# EAGLE design Quad-Thermocouple-Interface (EAGLE 6.1)
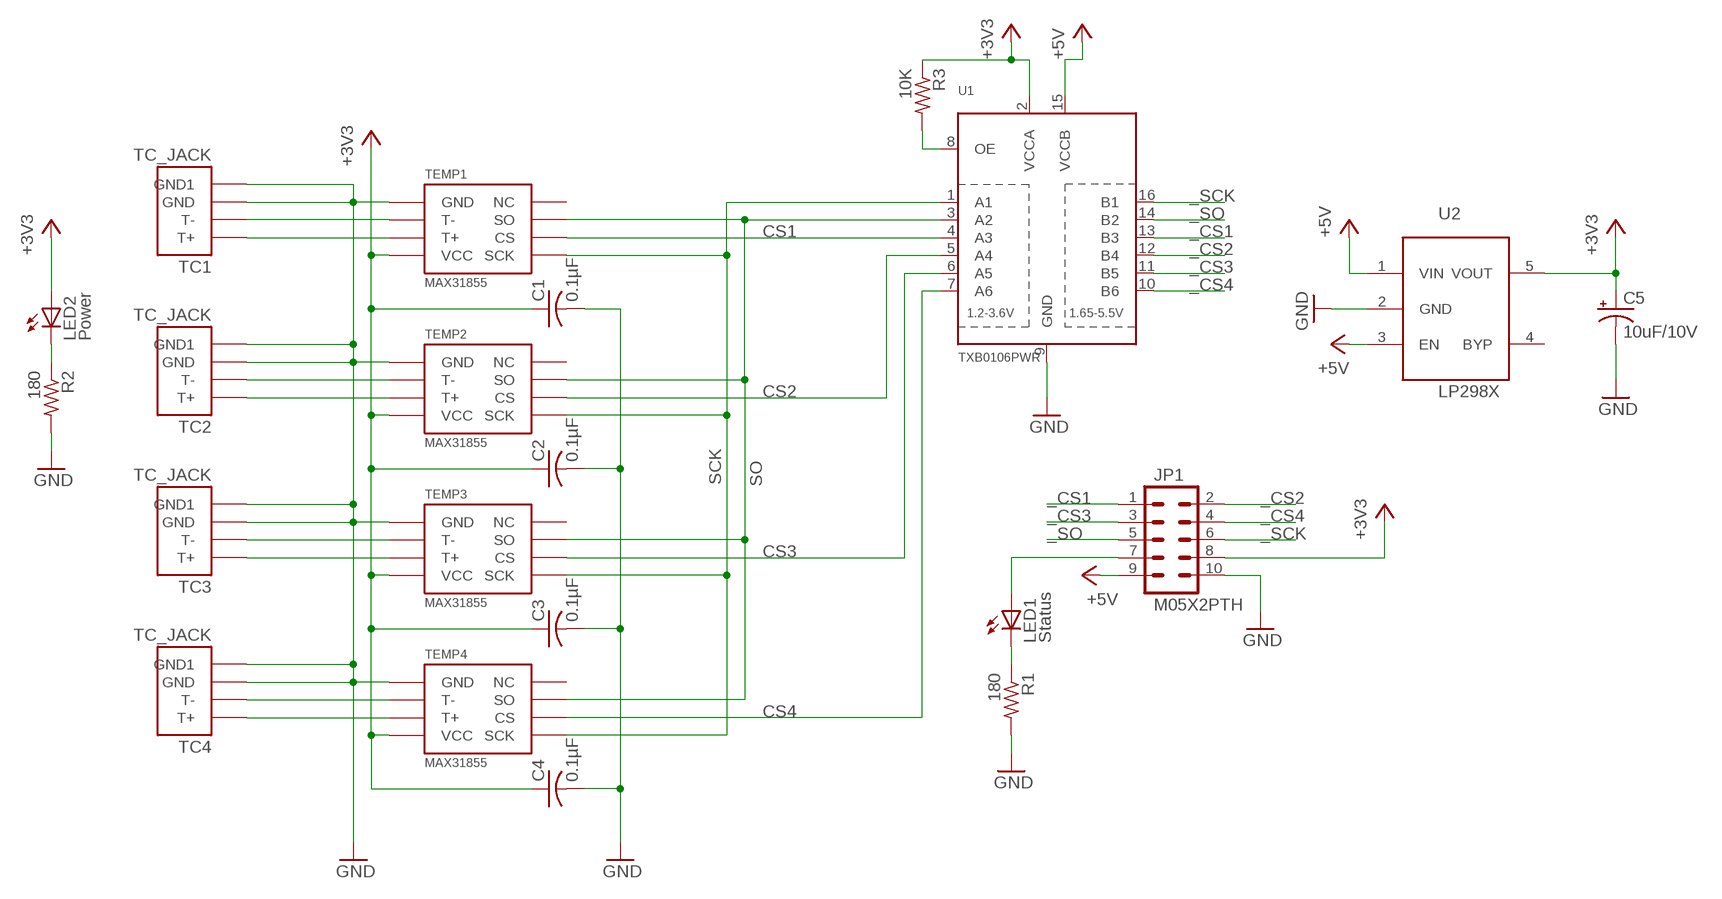
[diagram p0: schematic, sheet 1]

## Parts
C1  0.1µF  C-USC0603  [C0603]
C2  0.1µF  C-USC0603  [C0603]
C3  0.1µF  C-USC0603  [C0603]
C4  0.1µF  C-USC0603  [C0603]
C5  10uF/10V  CPOL-USA/3216-18R  [A/3216-18R]
JP1  M05X2PTH  [AVR_ICSP]
LED1  Status  LEDCHIPLED_0805  [CHIPLED_0805]
LED2  Power  LEDCHIPLED_0805  [CHIPLED_0805]
R1  180  R-US_R0603  [R0603]
R2  180  R-US_R0603  [R0603]
R3  10K  R-US_R0603  [R0603]
TC1  TC_JACK  [TC_JACK]
TC2  TC_JACK  [TC_JACK]
TC3  TC_JACK  [TC_JACK]
TC4  TC_JACK  [TC_JACK]
TEMP1  MAX31855  MAX6675MAX31855  [SOIC-8]
TEMP2  MAX31855  MAX6675MAX31855  [SOIC-8]
TEMP3  MAX31855  MAX6675MAX31855  [SOIC-8]
TEMP4  MAX31855  MAX6675MAX31855  [SOIC-8]
U1  TXB0106PWR  [TSSOP16]
U2  LP298XS  [SOT23-5L]

## Nets
+3V3: C1.1 C2.1 C3.1 C4.1 C5.+ JP1.8 LED2.A R3.1 TEMP1.VCC TEMP2.VCC TEMP3.VCC TEMP4.VCC U1.2(VCCA) U2.5(VOUT)
+5V: JP1.9 U1.15(VCCB) U2.1(VIN) U2.3(EN)
_CS1: JP1.1 U1.13(B3)
_CS2: JP1.2 U1.12(B4)
_CS3: JP1.3 U1.11(B5)
_CS4: JP1.4 U1.10(B6)
_SCK: JP1.6 U1.16(B1)
_SO: JP1.5 U1.14(B2)
CS1: TEMP1.CS U1.4(A3)
CS2: TEMP2.CS U1.5(A4)
CS3: TEMP3.CS U1.6(A5)
CS4: TEMP4.CS U1.7(A6)
GND: C1.2 C2.2 C3.2 C4.2 C5.- JP1.10 R1.2 R2.2 TC1.P$1(GND) TC1.P$2(GND1) TC2.P$1(GND) TC2.P$2(GND1) TC3.P$1(GND) TC3.P$2(GND1) TC4.P$1(GND) TC4.P$2(GND1) TEMP1.GND TEMP2.GND TEMP3.GND TEMP4.GND U1.9(GND) U2.2(GND)
LED1: JP1.7 LED1.A
N$1: R3.2 U1.8(OE)
N$2: LED1.C R1.1
N$7: LED2.C R2.1
SCK: TEMP1.SCK TEMP2.SCK TEMP3.SCK TEMP4.SCK U1.1(A1)
SO: TEMP1.SO TEMP2.SO TEMP3.SO TEMP4.SO U1.3(A2)
T1: TC1.T+ TEMP1.T+
T1-: TC1.T- TEMP1.T-
T2: TC2.T+ TEMP2.T+
T2-: TC2.T- TEMP2.T-
T3: TC3.T+ TEMP3.T+
T3-: TC3.T- TEMP3.T-
T4: TC4.T+ TEMP4.T+
T4-: TC4.T- TEMP4.T-
Unconnected: TEMP1.NC TEMP2.NC TEMP3.NC TEMP4.NC U2.4(BYP)

## Library data of the parts
C1-C4 = resistor:C-US: CAPACITOR, American symbol
C5 = adafruit:CPOL-US: POLARIZED CAPACITOR, American symbol
JP1 = SparkFun:M05X2: Header 5x2 Standard 10-pin dual row 0.1" header. Commonly used with AVR-ISP. Use with Spark Fun Electronics SKU: PRT-00778
LED1 LED2 = led:LED: LED OSRAM: - CHIPLED LG R971, LG N971, LY N971, LG Q971, LY Q971, LO R971, LY R971 LH N974, LH R974 LS Q976, LO Q976, LY Q976 LO Q996 - Hyper CHIPLED LW Q18S LB Q993, LB Q99A, LB R99A - SideLED LS A670, LO A670, LY A670, LG A670, LP A670 LB A673, LV A673, LT A673, LW A673 LH A674 LY A675 LS A676, LA A676, LO A676, LY A676, LW A676 LS A679, LY A679, LG A679 - Hyper Micro SIDELED® LS Y876, LA Y876, LO Y876, LY Y876 LT Y87S - SmartLED LW L88C, LW L88S LB L89C, LB L89S, LG L890 LS L89K, LO L89K, LY L89K LS L896, LA L896, LO L896, LY L896 - TOPLED LS T670, LO T670, LY T670, LG T670, LP T670 LSG T670, LSP T670, LSY T670, LOP T670, LYG T670 LG T671, LOG T671, LSG T671 LB T673, LV T673, LT T673, LW T673 LH T674 LS T676, LA T676, LO T676, LY T676, LB T676, LH T676, LSB T676, LW T676 LB T67C, LV T67C, LT T67C, LS T67K, LO T67K, LY T67K, LW E67C LS E67B, LA E67B, LO E67B, LY E67B, LB E67C, LV E67C, LT E67C LW T67C LS T679, LY T679, LG T679 LS T770, LO T770, LY T770, LG T770, LP T770 LB T773, LV T773, LT T773, LW T773 LH T774 LS E675, LA E675, LY E675, LS T675 LS T776, LA T776, LO T776, LY T776, LB T776 LHGB T686 LT T68C, LB T68C - Hyper Mini TOPLED® LB M676 - Mini TOPLED Santana® LG M470 LS M47K, LO M47K, LY M47K Source: http://www.osram.convergy.de LUXEON: - LUMILED® LXK2-PW12-R00, LXK2-PW12-S00, LXK2-PW14-U00, LXK2-PW14-V00 LXK2-PM12-R00, LXK2-PM12-S00, LXK2-PM14-U00 LXK2-PE12-Q00, LXK2-PE12-R00, LXK2-PE12-S00, LXK2-PE14-T00, LXK2-PE14-U00 LXK2-PB12-K00, LXK2-PB12-L00, LXK2-PB12-M00, LXK2-PB14-N00, LXK2-PB14-P00, LXK2-PB14-Q00 LXK2-PR12-L00, LXK2-PR12-M00, LXK2-PR14-Q00, LXK2-PR14-R00 LXK2-PD12-Q00, LXK2-PD12-R00, LXK2-PD12-S00 LXK2-PH12-R00, LXK2-PH12-S00 LXK2-PL12-P00, LXK2-PL12-Q00, LXK2-PL12-R00 Source: www.luxeon.com KINGBRIGHT: KA-3528ASYC Source: www.kingbright.com
R1-R3 = resistor:R-US_: RESISTOR, American symbol
TC1-TC4 = McLaughlinEng:TC_JACK
TEMP1-TEMP4 = McLEng:MAX6675
U1 = McLEng:TXB0106PWR: 6-Bit Bi-Directional Level Shifter 1.2V-3.6V (VCCA) to 1.65V-5.5V (VCCB) bi-directional level shifter with auto direction sensing. Max data rate - VCCA 1.8V: 20Mbps (50ns), VCCA 3.3V: 100Mbps (10ns) Digikey: 296-23759-1-ND
U2 = adafruit:LP298X

## Board
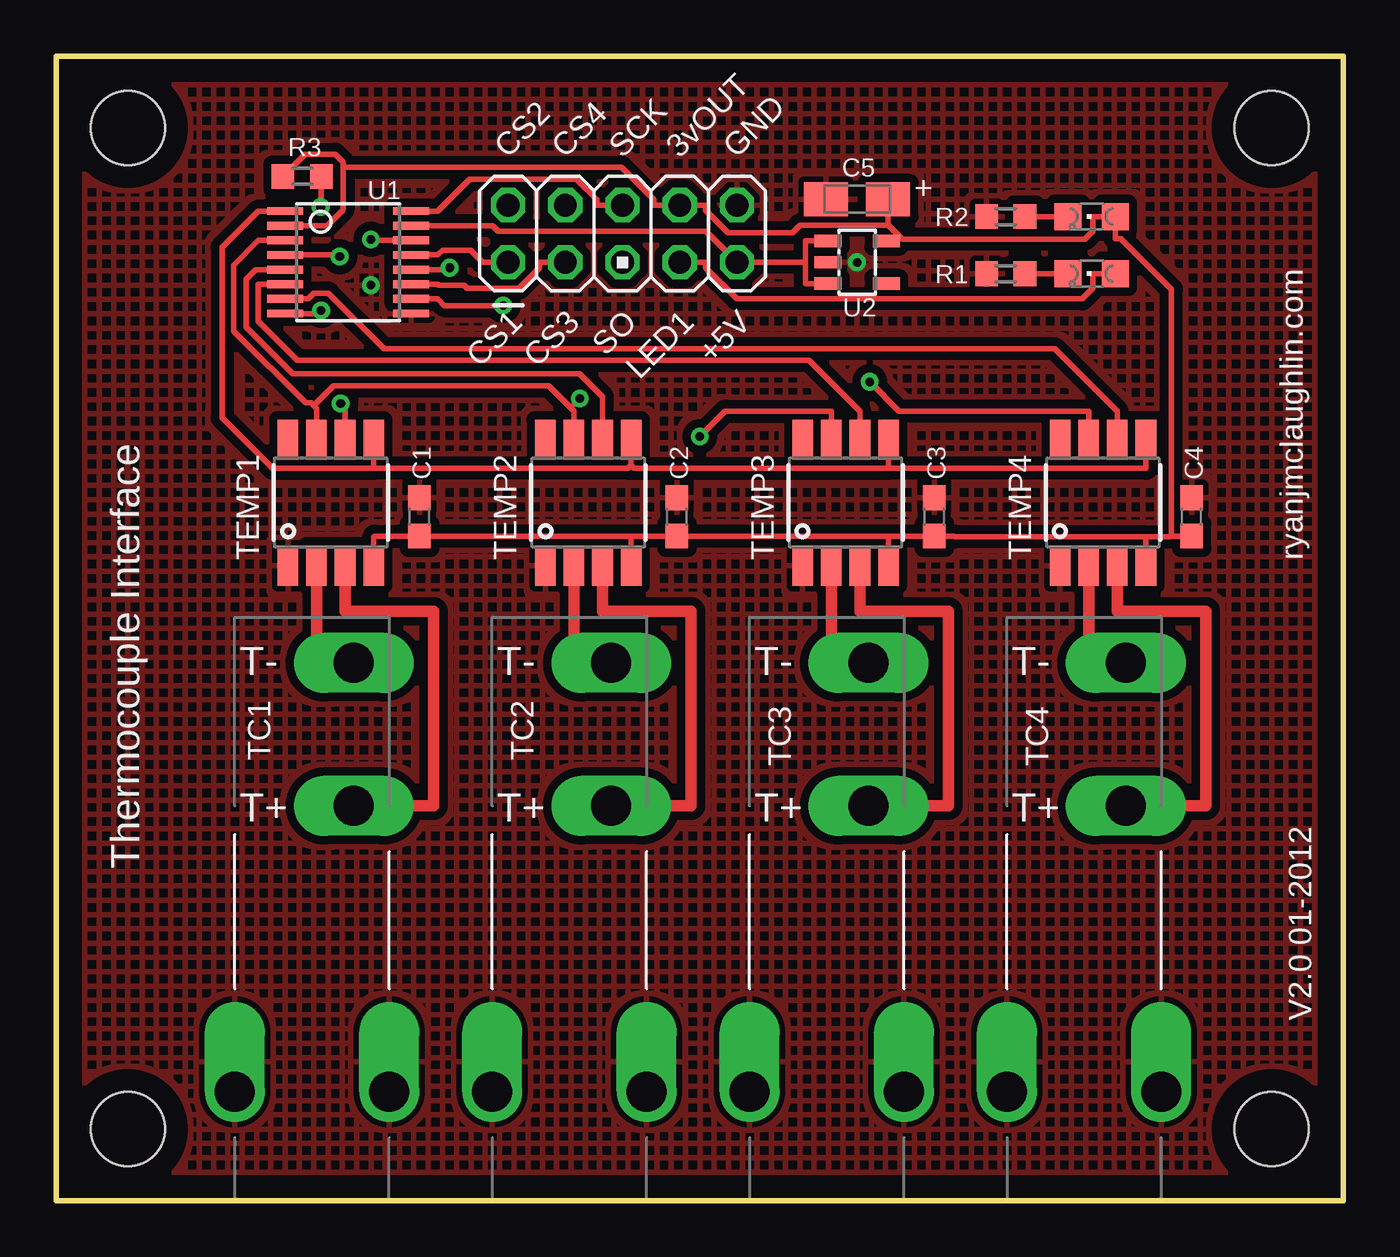
[diagram p1: board, top side]
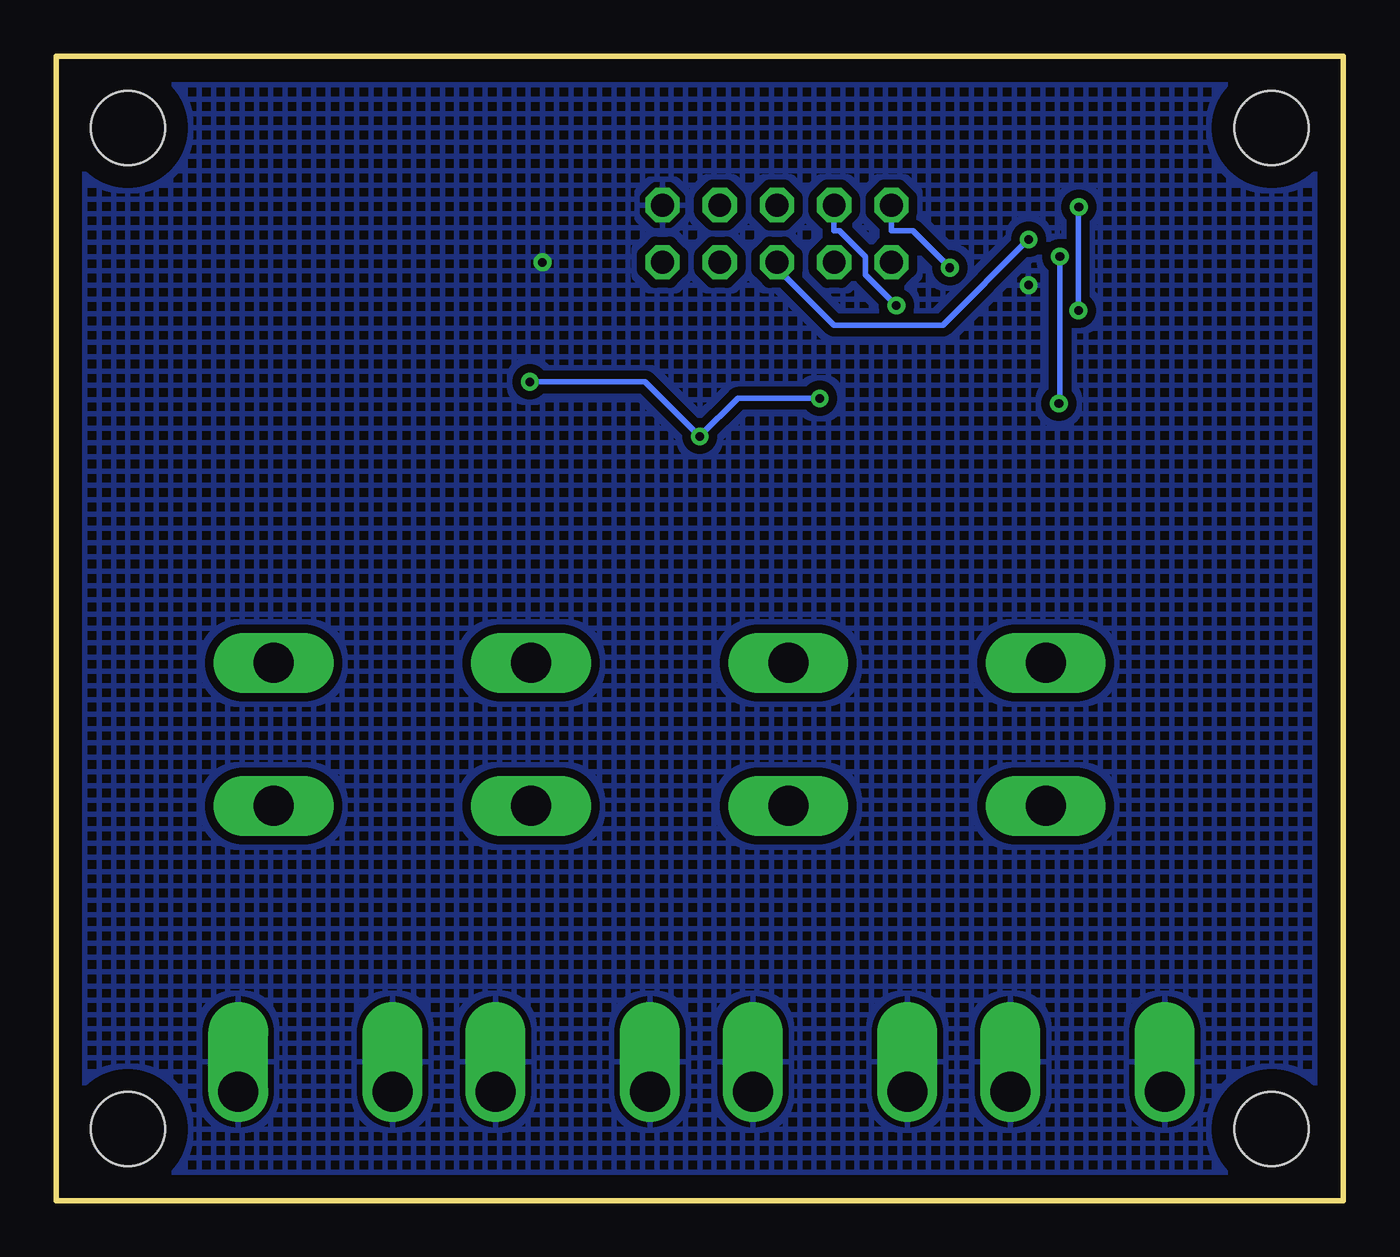
[diagram p2: board, bottom side, seen from below]

Size 57.15 x 50.8 mm. Coordinates in mm from the lower left corner, seen from the top.
Outline: 0,0 57.15,0 57.15,50.8 0,50.8 0,0
Copper layers (1*16): Top 0.035mm / dielectric 1.5mm / Bottom 0.035mm
Design rules: minimum track width 10mil, minimum drill 15mil, track to track 10mil, track to pad 10mil, pad to pad 8mil, via to via 10mil, smd to smd 8mil, copper to edge 40mil, drill to drill 10mil, minimum pad ring 10mil, minimum via ring 8mil, stop-mask expansion 4mil, vias tented up to drill 25mil, thermal gap 10mil

### Footprints (pad centres in the part's own frame; a part is rotated, then mirrored left to right if it is on the bottom)
C0603 = smd 1.1 x 1: 1 -0.85,0; 2 0.85,0
A/3216-18R = smd 1.95 x 1.5: + 1.375,0; - -1.375,0
AVR_ICSP = drill 1.016 octagon: 1 -1.27,5.08; 2 1.27,5.08; 3 -1.27,2.54; 4 1.27,2.54; 5 -1.27,0; 6 1.27,0; 7 -1.27,-2.54; 8 1.27,-2.54; 9 -1.27,-5.08; 10 1.27,-5.08
CHIPLED_0805 = smd 1.2 x 1.2: A 0,-1.05; C 0,1.05
R0603 = smd 1 x 1.1: 1 -0.85,0; 2 0.85,0
TC_JACK = drill 1.778 offset: P$1 -5.283,0; P$2 1.575,0 | drill 1.778 long: T+ 0,12.7; T- 0,19.05
SOIC-8 = smd 1.778 x 0.914: CS 2.794,-0.635; GND -2.794,1.905; NC 2.794,1.905; SCK 2.794,-1.905; SO 2.794,0.635; T+ -2.794,-0.635; T- -2.794,0.635; VCC -2.794,-1.905
TSSOP16 = smd 0.35 x 1.6: 1 -2.275,-2.8; 2 -1.625,-2.8; 3 -0.975,-2.8; 4 -0.325,-2.8; 5 0.325,-2.8; 6 0.975,-2.8; 7 1.625,-2.8; 8 2.275,-2.8; 9 2.275,2.8; 10 1.625,2.8; 11 0.975,2.8; 12 0.325,2.8; 13 -0.325,2.8; 14 -0.975,2.8; 15 -1.625,2.8; 16 -2.275,2.8
SOT23-5L = smd 0.55 x 1.2: 1 -0.95,-1.3; 2 0,-1.3; 3 0.95,-1.3; 4 0.95,1.3; 5 -0.95,1.3
STAND-OFF = hole 3.302: 0,0

### Placement (x,y rotation side)
C1  16.13,30.35 90 top
C2  27.56,30.35 90 top
C3  38.99,30.35 90 top
C4  50.42,30.35 90 top
C5  35.56,44.45 0 top
JP1  25.15,42.93 90 top
LED1  45.97,41.15 90 top
LED2  45.97,43.69 90 top
R1  42.16,41.15 180 top
R2  42.16,43.69 180 top
R3  10.92,45.47 0 top
TC1  13.21,4.83 0 top
TC2  24.64,4.83 0 top
TC3  36.07,4.83 0 top
TC4  47.5,4.83 0 top
TEMP1  12.19,30.99 90 top
TEMP2  23.62,30.99 90 top
TEMP3  35.05,30.99 90 top
TEMP4  46.48,30.99 90 top
U1  12.95,41.66 270 top
U2  35.56,41.66 270 top
U$1  [STAND-OFF]  3.17,3.17 0 top
U$2  [STAND-OFF]  3.17,47.62 0 top
U$3  [STAND-OFF]  53.98,47.62 0 top
U$4  [STAND-OFF]  53.98,3.17 0 top

### Tracks (layer width: path | path; a pad name or v marks a point on that pad's centre or on a via)
+3V3
  Top 0.254: 36.94,43.32 36.92,43.31 33.02,43.31 32.69,42.98 29.82,42.98 28.83,43.97 28.83,44.2 JP1.8 26.54,44.2 26.54,44.43 25.09,45.89 12.73,45.89 | 36.94,43.32 | 36.94,43.32 36.94,44.01 C5.+ | 12.73,45.89 12.73,43.98 12.03,43.28 U1.2 | R3.1 11.06,46.45 12.37,46.45 12.73,46.1 12.73,45.89 | 49.52,29.5 49.52,40.46 47.27,42.71 47.02,42.71 LED2.A 46.04,43.69 46.04,43.04 45.68,42.68 37.57,42.68 37.5,42.76 | 48.39,29.46 49.48,29.46 49.52,29.5 | 49.52,29.5 49.54,29.5 C4.1 | 37.5,42.76 36.94,43.32 | 37.5,42.76 37.35,42.61 U2.5 | 48.39,29.46 39.91,29.46 39.87,29.5 C3.1 38.11,29.5 37,29.5 36.96,29.46 | 48.39,29.46 48.39,29.34 TEMP4.VCC | 36.96,29.46 36.92,29.5 28.44,29.5 C2.1 26.68,29.5 25.57,29.5 25.53,29.46 | 36.96,29.46 36.96,29.34 TEMP3.VCC | TEMP1.VCC 14.1,29.46 14.14,29.5 15.25,29.5 C1.1 16.57,29.5 17.01,29.5 25.49,29.5 25.53,29.46 | 25.53,29.46 25.53,29.34 TEMP2.VCC
+5V
  Top 0.254: U1.15 19.36,43.28 19.62,43.03 28.86,43.03 JP1.9 33.28,41.66 | 33.28,41.66 33.28,40.71 U2.3 | 33.28,41.66 | 33.28,41.66 33.28,42.61 | 33.28,42.61 | U2.1 33.28,42.61
_CS1
  Top 0.254: JP1.1 18.92,41.66 18.39,42.19 17.14,42.19 16.93,41.98 U1.13
_CS2  (via drill 0.38 pad 0.79)
  Top 0.254: U1.12 17.39,41.33 v17.47,41.41
  Bottom 0.254: v17.47,41.41 19.11,43.05 20.07,43.05 JP1.2
_CS3
  Top 0.254: JP1.3 21.46,41.66 21.46,41.42 20.56,40.51 18.24,40.51 18.12,40.64 16.98,40.64 16.93,40.68 U1.11
_CS4  (via drill 0.38 pad 0.79)
  Top 0.254: U1.10 16.93,40.03 17.23,39.74 v19.84,39.74
  Bottom 0.254: JP1.4 22.61,43.05 22.37,43.05 21.21,41.89 21.21,41.1 v19.84,39.74
_SCK
  Top 0.254: JP1.6 24,44.2 24,44.43 23.09,45.35 18.35,45.35 16.93,43.93 U1.16
_SO  (via drill 0.38 pad 0.79)
  Top 0.254: U1.14 13.97,42.63 v13.97,42.67
  Bottom 0.254: v13.97,42.67 17.78,38.86 22.61,38.86 25.15,41.4 JP1.5
CS1  (via drill 0.38 pad 0.79)
  Top 0.254: v12.63,35.39 12.83,35.19 TEMP1.CS | U1.4 12.51,41.98 v12.58,41.91
  Bottom 0.254: v12.58,41.91 12.58,35.44 v12.63,35.39
CS2
  Top 0.254: U1.5 8.85,41.33 8.43,40.91 8.43,38.77 10.49,36.71 23.24,36.71 24.26,35.7 24.26,35.05 TEMP2.CS
CS3
  Top 0.254: TEMP3.CS 35.69,35.05 33.43,37.31 10.71,37.31 8.97,39.04 8.97,40.68 U1.6
CS4
  Top 0.254: U1.7 11.18,40.03 11.44,40.29 12.08,40.29 14.56,37.81 44.35,37.81 47.12,35.05 TEMP4.CS
GND  (via drill 0.38 pad 0.79)
  other vias: 35.56,41.66 13.97,40.64
  pour Top (isolate 0.381, hatched): 0,50.8 57.15,50.8 57.15,0 0,0
  pour Bottom (isolate 0.381, hatched): 0,0 0,50.8 57.15,50.8 57.15,0
LED1
  Top 0.254: JP1.7 28.83,41.66 28.83,41.42 30.22,40.03 45.57,40.03 46.04,40.5 46.04,41.15 LED1.A
N$1  (via drill 0.38 pad 0.79)
  Top 0.254: R3.2 11.77,44.53 11.74,44.5 v11.74,44.11 | U1.8 11.62,39.38 v11.76,39.52
  Bottom 0.254: v11.76,39.52 11.76,44.1 v11.74,44.11
N$2
  Top 0.254: R1.1 LED1.C
N$7
  Top 0.254: R2.1 LED2.C
SCK
  Top 0.254: TEMP4.SCK 48.39,32.51 36.96,32.51 | TEMP3.SCK 36.96,32.51 | 25.53,32.64 25.65,32.51 36.96,32.51 | 25.53,32.64 25.4,32.51 14.1,32.51 | TEMP2.SCK 25.53,32.64 | TEMP1.SCK 14.1,32.51 | U1.1 8.97,43.93 7.36,42.32 7.36,34.77 9.62,32.51 14.1,32.51
SO  (via drill 0.38 pad 0.79)
  Top 0.254: 22.84,35.2 22.99,35.05 TEMP2.SO | 11.43,35.29 12.32,36.18 21.86,36.18 22.84,35.2 | v23.25,35.61 22.84,35.2 | v28.58,33.92 29.7,35.05 34.42,35.05 TEMP3.SO | 11.43,35.29 11.56,35.17 11.56,35.05 TEMP1.SO | 11.43,35.29 11.31,35.42 11.06,35.42 7.88,38.6 7.88,41.53 8.97,42.63 U1.3 | TEMP4.SO 45.85,35.05 37.42,35.05 v36.12,36.35
  Bottom 0.254: v23.25,35.61 26.89,35.61 v28.58,33.92 31,36.35 v36.12,36.35
T1
  Top 0.508: TEMP1.T+ 12.83,26.16 16.76,26.16 16.76,17.53 TC1.T+
T1-
  Top 0.508: TEMP1.T- 11.56,23.88 TC1.T-
T2
  Top 0.508: TEMP2.T+ 24.26,26.16 28.19,26.16 28.19,17.53 TC2.T+
T2-
  Top 0.508: TEMP2.T- 22.99,23.88 TC2.T-
T3
  Top 0.508: TEMP3.T+ 35.69,26.16 39.62,26.16 39.62,17.53 TC3.T+
T3-
  Top 0.508: TEMP3.T- 34.42,23.88 TC3.T-
T4
  Top 0.508: TEMP4.T+ 47.12,26.16 51.05,26.16 51.05,17.53 TC4.T+
T4-
  Top 0.508: TEMP4.T- 45.85,23.88 TC4.T-

### Text on the board
tPlace: ryanjmclaughlin.com | Thermocouple Interface | V2.0 01-2012
tNames: CS2 | CS4 | SCK | 3vOUT | GND | CS1 | CS3 | SO | LED1 | +5V